# Altium schematic sheet MCU.SchDoc: USB_HUB 3.0
size A3; DrawnBy: Luca Schenetti; Revision: A; SheetNumber: 3; SheetTotal: 10
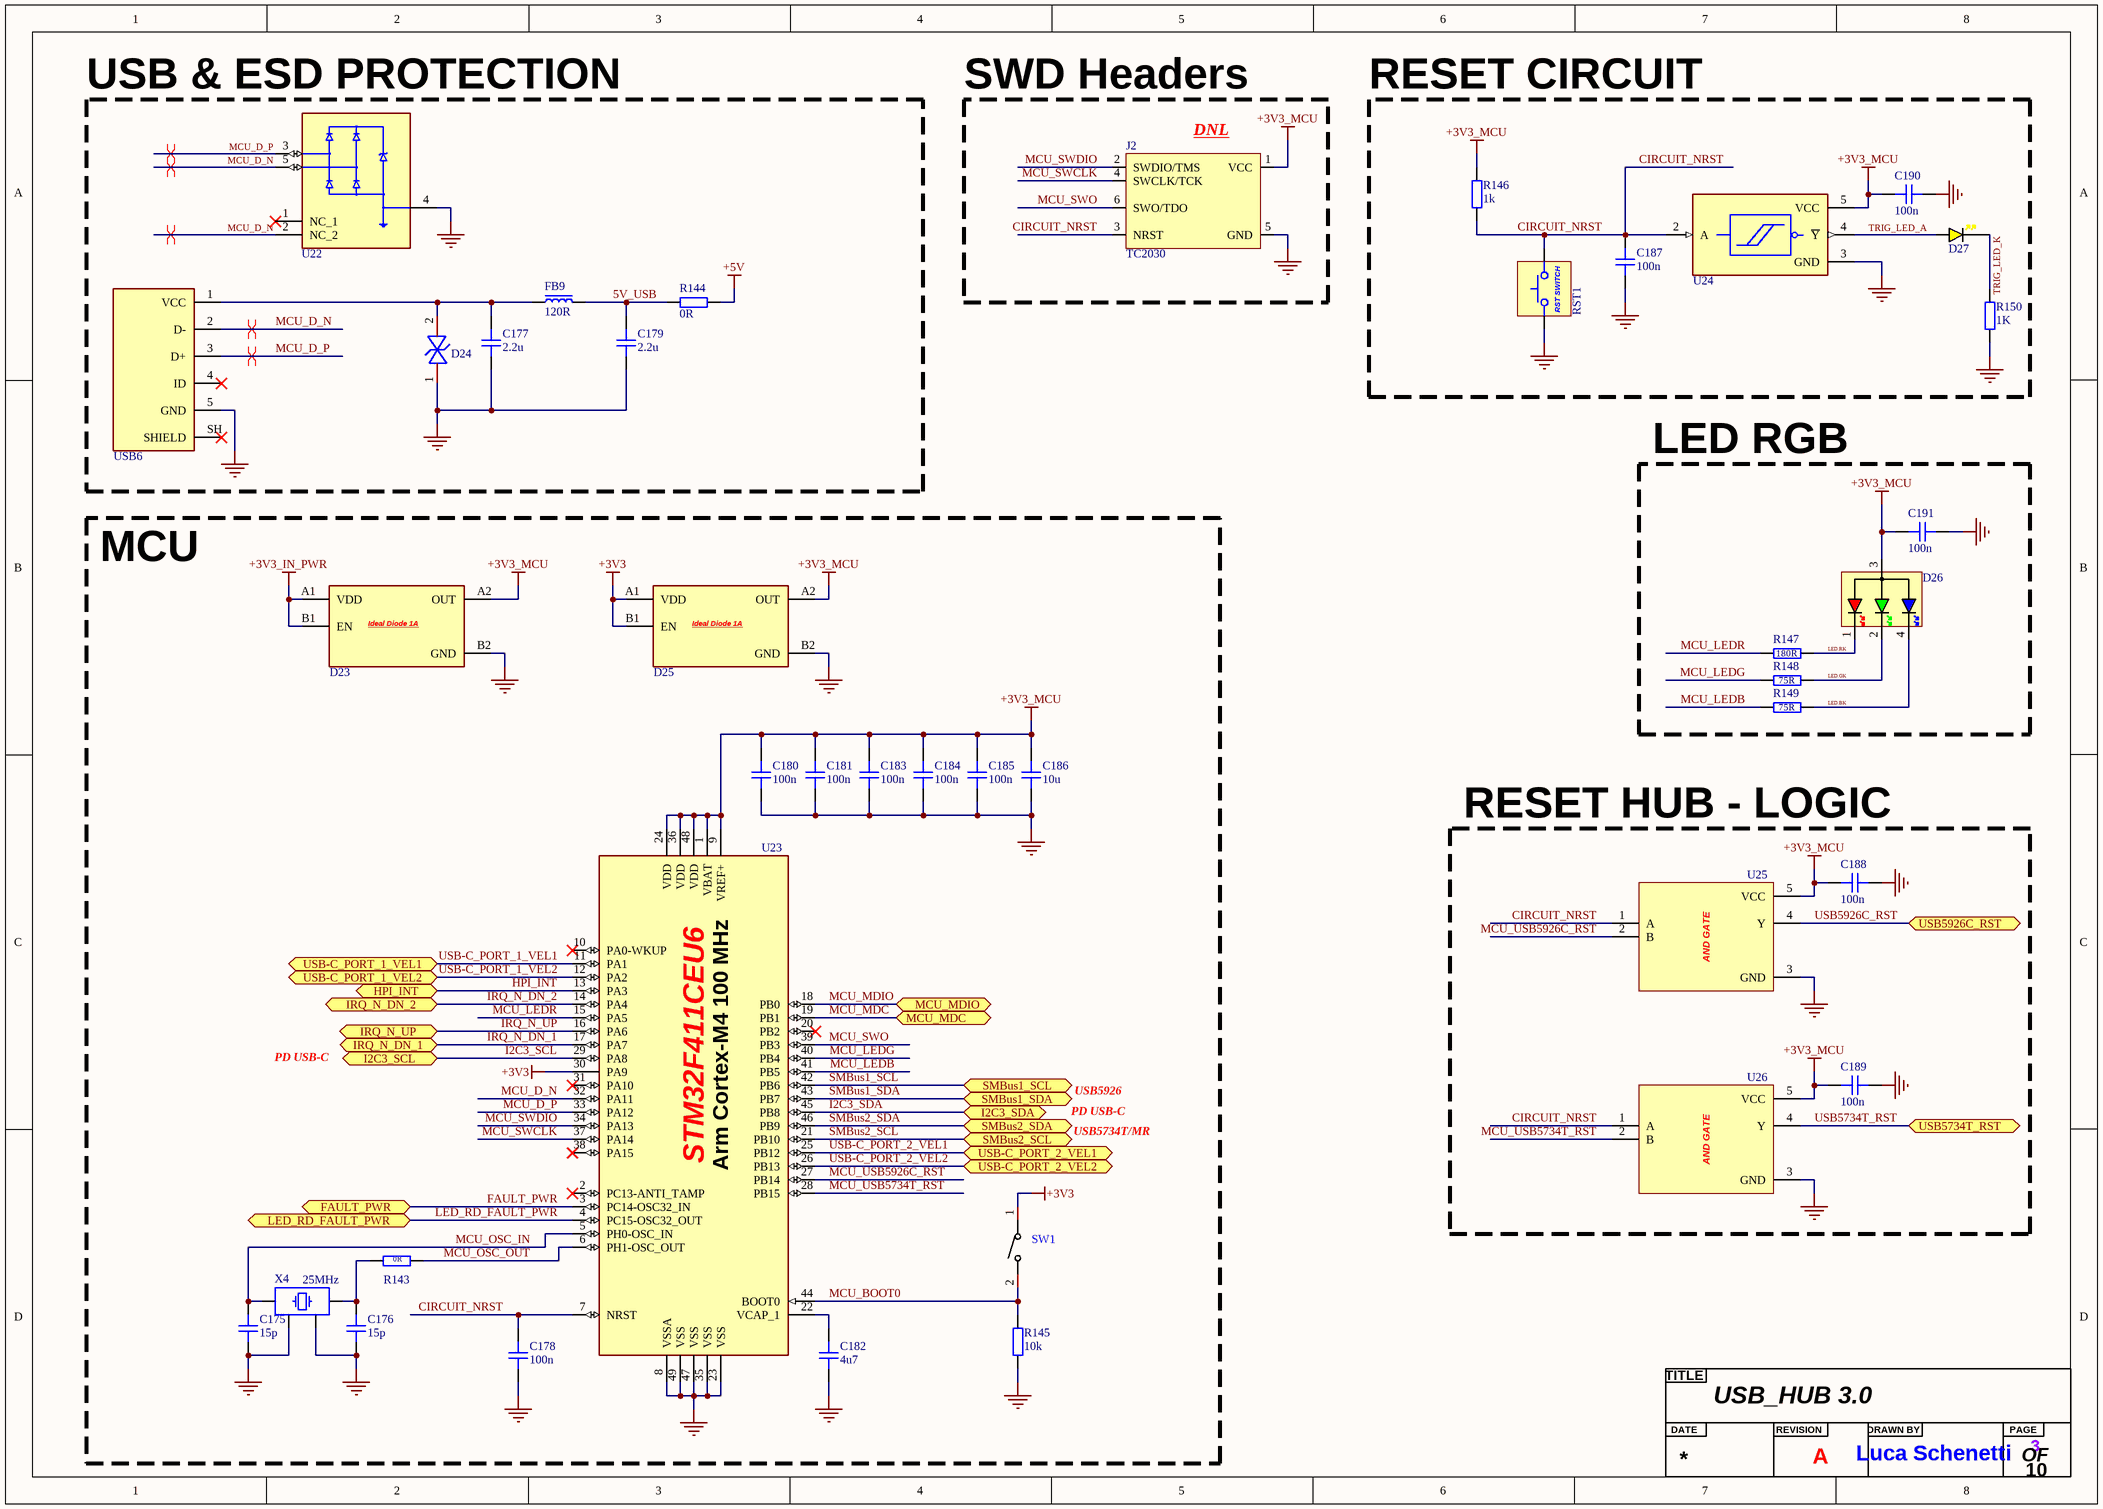
[diagram p0: MCU.SchDoc]

## Parts
?  Title  (value not drawn)  (graphical)
C175  15p  [CAP_0402]
C176  15p  [CAP_0402]
C177  2.2u  [CAP_0603]
C178  100n  [CAP_0603]
C179  2.2u  [CAP_0603]
C180  100n  [CAP_0603]
C181  100n  [CAP_0603]
C182  4u7  [CAP_0603]
C183  100n  [CAP_0603]
C184  100n  [CAP_0603]
C185  100n  [CAP_0603]
C186  10u  [CAP_0603]
C187  100n  [CAP_0402]
C188  100n  [CAP_0402]
C189  100n  [CAP_0402]
C190  100n  [CAP_0402]
C191  100n  [CAP_0402]
D23  1A Ideal Diode  [MAX40200ANS+T]  (value not drawn)
D24  ESD Protection TVS 6.0V  [SMF6.0CA]  (value not drawn)
D25  1A Ideal Diode  [MAX40200ANS+T]  (value not drawn)
D26  RGB_LED  [XL-2012RGBC]  (value not drawn)
D27  YELLOW  [LED_0603_YELLOW]  (value not drawn)
FB9  120R  [FB_0603]
J2  TC2030  [TC2030-FP]  (no BOM)
R143  0R  [RES_0402]
R144  0R  [RES_0603]
R145  10k  [RES_0603]
R146  1k  [RES_0402]
R147  180R  [RES_0603]
R148  75R  [RES_0603]
R149  75R  [RES_0603]
R150  1K  [RES_0402]
RST1  RST_SWITCH_STM32  [RST_SWITCH]  (value not drawn)
SW1  TS-1088-AR02016  [TS-1088-AR02016]  (value not drawn)
U22  TVS USB 2.0 ±25-kV  [TPD2E2U06DRLR]  (value not drawn)
U23  ARM® Cortex®-M4 STM32F4  [STM32F411CEU6]  (value not drawn)
U24  Schmitt Trigger 1.65V~5.5V  [74LVC1G14GW,125]  (value not drawn)
U25  AND GATE  [SN74LVC1G08DBVR]  (value not drawn)
U26  AND GATE  [SN74LVC1G08DBVR]  (value not drawn)
USB6  USB 2.0 MICRO B  [10118194-0001LF]  (value not drawn)
X4  25MHz  [XTAL_3225]

## Blocks framed on the sheet
USB & ESD PROTECTION: C177 C179 D24 FB9 R144 U22 USB6
SWD Headers: J2
RESET CIRCUIT: C187 C190 D27 R146 R150 RST1 U24
LED RGB: C191 D26 R147-R149
MCU: C175 C176 C178 C180-C186 D23 D25 R143 R145 SW1 U23 X4
RESET HUB - LOGIC: C188 C189 U25 U26

## Ports
FAULT_PWR (bidir, see PWR[4B]), HPI_INT (bidir, see PWR[4B]), I2C3_SCL (bidir, see PWR[4B], PWR[11A], USB_HUB1 DN PORT 1_2[5B], USB_HUB1 DN PORT 1_2[5D], USB_HUB1 UP PORT0[5B]), I2C3_SDA (bidir, see PWR[4B], PWR[11A], USB_HUB1 DN PORT 1_2[5B], USB_HUB1 DN PORT 1_2[5D], USB_HUB1 UP PORT0[5B]), IRQ_N_DN_1 (bidir, see USB_HUB1 DN PORT 1_2[5B]), IRQ_N_DN_2 (bidir, see USB_HUB1 DN PORT 1_2[5D]), IRQ_N_UP (bidir, see USB_HUB1 UP PORT0[5B]), LED_RD_FAULT_PWR (bidir, see PWR[1D]), MCU_MDC (bidir, see USB_HUB1 DN PORT 5[2B]), MCU_MDIO (bidir, see USB_HUB1 DN PORT 5[2B]), SMBus1_SCL (bidir, see USB_HUB1[3C]), SMBus1_SDA (bidir, see USB_HUB1[3C]), SMBus2_SCL (bidir, see USB_HUB1 DN PORT 3[1C]), SMBus2_SDA (bidir, see USB_HUB1 DN PORT 3[1C]), USB5734T_RST (bidir, see USB_HUB1 DN PORT 3[2D]), USB5926C_RST (bidir, see USB_HUB1 DN PORT 1_2[5B], USB_HUB1 DN PORT 1_2[5D], USB_HUB1 DN PORT 5[3D], USB_HUB1 DN PORT 6[1C], USB_HUB1 UP PORT0[5C], USB_HUB1[3C]), USB-C_PORT_1_VEL1 (bidir, see USB_HUB1 DN PORT 1_2[3B]), USB-C_PORT_1_VEL2 (bidir, see USB_HUB1 DN PORT 1_2[3B]), USB-C_PORT_2_VEL1 (bidir, see USB_HUB1 DN PORT 1_2[3D]), USB-C_PORT_2_VEL2 (bidir, see USB_HUB1 DN PORT 1_2[3D])

## Nets
+3V3: D25.A1(VDD) D25.B1(EN) SW1.1 U23.30(PA9)
+3V3_IN_PWR: D23.A1(VDD) D23.B1(EN)
+3V3_MCU: C180.2 C181.2 C183.2 C184.2 C185.2 C186.2 C188.2 C189.2 C190.2 C191.2 D23.A2(OUT) D25.A2(OUT) D26.3(AC) J2.1(VCC) R146.2 U23.1(VBAT) U23.9(VREF+) U23.24(VDD) U23.36(VDD) U23.48(VDD) U24.5(VCC) U25.5(VCC) U26.5(VCC)
+5V: R144.2
GND: C175.1 C176.1 C177.1 C178.1 C179.1 C180.1 C181.1 C182.1 C183.1 C184.1 C185.1 C186.1 C187.1 C188.1 C189.1 C190.1 C191.1 D23.B2(GND) D24.1(C) D25.B2(GND) J2.5(GND) R145.1 R150.1 RST1.1 U22.4(GND) U23.8(VSSA) U23.23(VSS) U23.35(VSS) U23.47(VSS) U23.49(VSS) U24.3(GND) U25.3(GND) U26.3(GND) USB6.5(GND) X4.2 X4.4
5V_USB: C179.2 FB9.2 R144.1
CIRCUIT_NRST: C178.2 C187.2 J2.3(NRST) R146.1 RST1.2 U23.7(NRST) U24.2(A) U25.1(A) U26.1(A)
FAULT_PWR: U23.3(PC14-OSC32_IN) ; port FAULT_PWR
HPI_INT: U23.13(PA3) ; port HPI_INT
I2C3_SCL: U23.29(PA8) ; port I2C3_SCL
I2C3_SDA: U23.45(PB8) ; port I2C3_SDA
IRQ_N_DN_1: U23.17(PA7) ; port IRQ_N_DN_1
IRQ_N_DN_2: U23.14(PA4) ; port IRQ_N_DN_2
IRQ_N_UP: U23.16(PA6) ; port IRQ_N_UP
LED.BK: D26.4(CB) R149.1
LED.GK: D26.2(CG) R148.1
LED.RK: D26.1(CR) R147.1
LED_RD_FAULT_PWR: U23.4(PC15-OSC32_OUT) ; port LED_RD_FAULT_PWR
MCU_BOOT0: R145.2 SW1.2 U23.44(BOOT0)
MCU_D_N: U22.2(NC_2) U22.5(IO2) U23.32(PA11) USB6.2(D-)
MCU_D_P: U22.3(IO1) U23.33(PA12) USB6.3(D+)
MCU_LEDB: R149.2 U23.41(PB5)
MCU_LEDG: R148.2 U23.40(PB4)
MCU_LEDR: R147.2 U23.15(PA5)
MCU_MDC: U23.19(PB1) ; port MCU_MDC
MCU_MDIO: U23.18(PB0) ; port MCU_MDIO
MCU_OSC_IN: C175.2 U23.5(PH0-OSC_IN) X4.3
MCU_OSC_OUT: R143.2 U23.6(PH1-OSC_OUT)
MCU_SWCLK: J2.4(SWCLK/TCK) U23.37(PA14)
MCU_SWDIO: J2.2(SWDIO/TMS) U23.34(PA13)
MCU_SWO: J2.6(SWO/TDO) U23.39(PB3)
MCU_USB5734T_RST: U23.28(PB15) U26.2(B)
MCU_USB5926C_RST: U23.27(PB14) U25.2(B)
SMBus1_SCL: U23.42(PB6) ; port SMBus1_SCL
SMBus1_SDA: U23.43(PB7) ; port SMBus1_SDA
SMBus2_SCL: U23.21(PB10) ; port SMBus2_SCL
SMBus2_SDA: U23.46(PB9) ; port SMBus2_SDA
TRIG_LED_A: D27.A U24.4(~{Y})
TRIG_LED_K: D27.K R150.2
USB5734T_RST: U26.4(Y) ; port USB5734T_RST
USB5926C_RST: U25.4(Y) ; port USB5926C_RST
USB-C_PORT_1_VEL1: U23.11(PA1) ; port USB-C_PORT_1_VEL1
USB-C_PORT_1_VEL2: U23.12(PA2) ; port USB-C_PORT_1_VEL2
USB-C_PORT_2_VEL1: U23.25(PB12) ; port USB-C_PORT_2_VEL1
USB-C_PORT_2_VEL2: U23.26(PB13) ; port USB-C_PORT_2_VEL2
NetC176_2: C176.2 R143.1 X4.1
NetC177_2: C177.2 D24.2(A) FB9.1 USB6.1(VCC)
NetC182_2: C182.2 U23.22(VCAP_1)

Not connected (* = marked no-connect by the designer): U22 1(NC_1)*; U23 2(PC13-ANTI_TAMP)* 10(PA0-WKUP)* 20(PB2)* 31(PA10)* 38(PA15)*; USB6 4(ID)* SH(SHIELD)*

## Layout directives
differential pair; differential pair class DIFF_USB_90Ω: MCU_D_N, MCU_D_P

## Notes on the sheet
- (near J2) DNL
- PD USB-C
- USB5926
- USB5734T/MR
- (in symbol MAX40200ANS+T) Ideal Diode 1A
- (in symbol RST_SWITCH) RST SWITCH
- (in symbol STM32F411CEU6) Arm Cortex-M4 100 MHz
- (in symbol Title) TITLE; DATE; REVISION; DRAWN BY; PAGE; OF

## Library data of the parts
C175 C176 = CAP_0402: Capacitor SMD 0402 [C1548]; Manufacturer: *; Manufacturer Part Number: *; Distributor Link: *; LCSC: *; Rating: *; Dielectric: *
C177 C179 = CAP_0603: Capacitor SMD 0603 [C23630]; Manufacturer: *; Manufacturer Part Number: *; Distributor Link: *; LCSC: *; Rating: *; Dielectric: *
C178 C180 C181 C183-C185 = CAP_0603: Capacitor SMD 0603 [C14663]; Manufacturer: *; Manufacturer Part Number: *; Distributor Link: *; LCSC: *; Rating: *; Dielectric: *
C182 = CAP_0603: Capacitor SMD 0603 [C19666]; Manufacturer: *; Manufacturer Part Number: *; Distributor Link: *; LCSC: *; Rating: *; Dielectric: *
C186 = CAP_0603: Capacitor SMD 0603 [C96446]; Manufacturer: *; Manufacturer Part Number: *; Distributor Link: *; LCSC: *; Rating: *; Dielectric: *
C187-C191 = CAP_0402: Capacitor SMD 0402 [C1525]; Manufacturer: *; Manufacturer Part Number: *; Distributor Link: *; LCSC: *; Rating: *; Dielectric: *
D23 D25 = MAX40200ANS+T: [C3227637]
D24 = SMF6.0CA: [C2990473]
D26 = RGB_LED_0805: [C965848]
D27 = LED_0603_YELLOW: LED 0603 YELLOW SMD[C72038]
FB9 = FB_0603: Ferrite Bead SMD 0603[C76892]; Manufacturer: *; Manufacturer Part Number: *; Distributor Link: *; LCSC: *
J2 = TC2030: Tag-Connect No-Solder SWD Debug Connector DO NOT PLACE; Manufacturer: Tag-Connect; Manufacturer Part Number: TC2030
R143 = RES_0402: Resistor SMD 0402 [C17168]; Manufacturer: *; Manufacturer Part Number: *; Distributor Link: *; LCSC: *
R144 = RES_0603: [C21189]; Manufacturer: *; Manufacturer Part Number: *; Distributor Link: *; LCSC: *
R145 = RES_0603: Resistor SMD 0603[C25804]; Manufacturer: *; Manufacturer Part Number: *; Distributor Link: *; LCSC: *
R146 R150 = RES_0402: Resistor SMD 0402 [C11702]; Manufacturer: *; Manufacturer Part Number: *; Distributor Link: *; LCSC: *
R147 = RES_0603: [C22828]; Manufacturer: *; Manufacturer Part Number: *; Distributor Link: *; LCSC: *
R148 R149 = RES_0603: [C4275]; Manufacturer: *; Manufacturer Part Number: *; Distributor Link: *; LCSC: *
RST1 = RST_SWITCH: [C720477]
SW1 = TS-1088-AR02016: [C720477]; Manufacturer: XUNPU(讯普); Add into BOM: yes; Circuit: SPST; Actuator Style: Round Button; Operating Force: 160gf; Switch Length: 4mm; Switch Width: 3mm; Switch Height: 2mm; Strike Gundam: 不带; Contact Current: 50mA; Voltage Rating (DC): 12V; Insulation Resistance: 100MΩ; Actuator/Cap Color: Black; Pin Style: SMDSplicing; Mechanical Life: 10万次; Symbol: TS-1088-AR02016; Device: TS-1088-AR02016; Supplier: LCSC; Supplier Part: C720477; Manufacturer Part: TS-1088-AR02016; JLCPCB Part Class: Extended Part; LCSC Part Name: 4*3*2mm 立贴 轻触开关; Supplier Footprint: SMD; Datasheet: https://atta.szlcsc.com/upload/public/pdf/source/20200810/C720475_60D09DD6C54279ADDB2DC25100F1CC11.pdf; Convert to PCB: yes; Mounting Style: Brick nogging; Operating Temperature: -30℃~+80℃
U22 = TPD2E2U06DRLR: [C1972959]
U23 = STM32F411CEU6: [C60420]
U24 = 74LVC1G14GW,125: [C265125]
U25 U26 = SN74LVC1G08DBVR: [C7666]
USB6 = 10118194-0001LF: [C132563]
X4 = TSX-3225_24.0000MF15X-AC: Crystal SMD 24MHz 10PPM 7pF 3225 [C9006]; Manufacturer: Epson; Manufacturer Part Number: TSX-3225 24.0000MF15X-AC